# Altium schematic sheet Differential_voltage_input.SchDoc
size A4; SheetNumber: 6; SheetTotal: 8
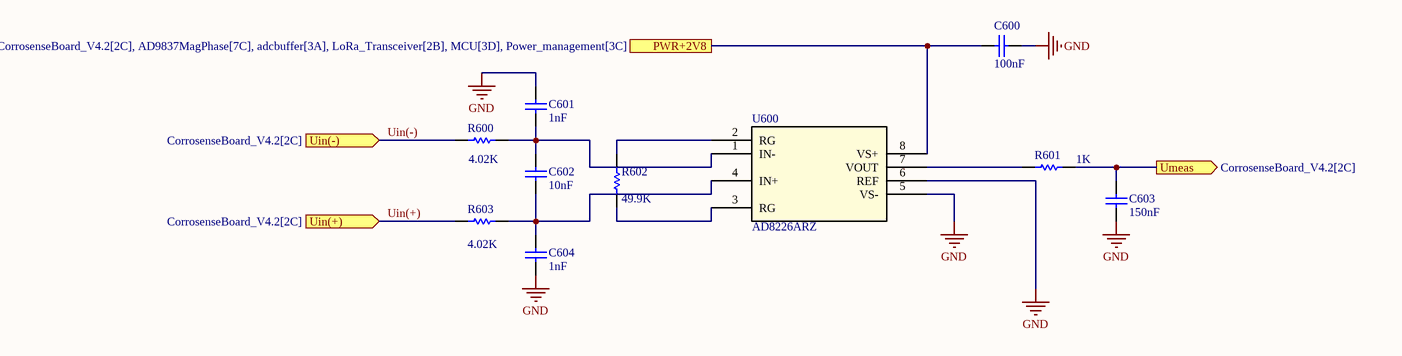
[diagram p0: Differential_voltage_input.SchDoc]

## Parts
C600  100nF  [1608[0603]]
C601  1nF  [1608[0603]]
C602  10nF  [1608[0603]]
C603  150nF  [1608[0603]]
C604  1nF  [1608[0603]]
R600  4.02K  [1608[0603]]
R601  1K  [1608[0603]]
R602  49.9K  [1608[0603]]
R603  4.02K  [1608[0603]]
U600  AD8226ARZ  [SOIC127P600X175-8N]

## Ports
PWR+2V8 (see CorrosenseBoard_V4.2[2C], AD9837MagPhase[7C], adcbuffer[3A], LoRa_Transceiver[2B], MCU[3D], Power_management[3C]), Uin(+) (in, see CorrosenseBoard_V4.2[2C]), Uin(-) (in, see CorrosenseBoard_V4.2[2C]), Umeas (out, see CorrosenseBoard_V4.2[2C])

## Nets
GND: C600.2 C601.1 C603.2 C604.2 U600.5(VS-) U600.6(REF)
PWR+2V8: C600.1 U600.8(VS+) ; port PWR+2V8
Uin(+): R603.1 ; port Uin(+)
Uin(-): R600.1 ; port Uin(-)
Umeas: C603.1 R601.2 ; port Umeas
NetC601_2: C601.2 C602.1 R600.2 U600.1(IN-)
NetC602_2: C602.2 C604.1 R603.2 U600.4(IN+)
NetR601_1: R601.1 U600.7(VOUT)
NetR602_1: R602.1 U600.3(RG)
NetR602_2: R602.2 U600.2(RG)

## Library data of the parts
C600 = Cap: CAP CER 25V X7R 0603; Manufacturer: Murata Electronics; MPN: GCJ188R71E104KA12D; Tolerance: ±10%; Value: 100nF; Operating Temperature: -55°C ~ 125°C; Package / Case: 0603 (1608 Metric); Temperature Coefficient: X7R; Voltage - Rated: 25V
C601 C604 = Cap: CAP CER 25V X7R 0603; Manufacturer: KYOCERA AVX; MPN: 06033C102KAT2A; Tolerance: ±10%; Value: 1nF; Operating Temperature: -55°C ~ 125°C; Package / Case: 0603 (1608 Metric); Temperature Coefficient: X7R; Voltage - Rated: 25V
C602 = Cap: CAP CER 25V X7R 0603; Manufacturer: Murata Electronics; MPN: GCJ188R71E103KA01J; Tolerance: ±10%; Value: 10nF; Operating Temperature: -55°C ~ 125°C; Package / Case: 0603 (1608 Metric); Temperature Coefficient: X7R; Voltage - Rated: 25V
C603 = Cap: CAP CER 25V X7R 0603; Manufacturer: Murata Electronics; MPN: GRM188R71E154KA01D; Tolerance: ±10%; Value: 150nF; Operating Temperature: -55°C ~ 125°C; Package / Case: 0603 (1608 Metric); Temperature Coefficient: X7R; Voltage - Rated: 25V
R600 R603 = Res1: RES SMD 2% 1.5W 0603; Manufacturer: YAGEO; MPN: AF0603FR-074K02L; MP: -65°C ~ 155°C; Publisher: Altium Limited; Value: 4.02K; Code_JEITA: Thick Film; Package: 0603 (1608 Metric); Temperature Coefficient: 2%; Composition: Thick Film; Operating Temperature: -65°C ~ 155°C; Power (Watts): 1.5W; Tolerance: 2%
R601 = Res1: RES SMD 2% 1.5W 0603; Manufacturer: YAGEO; MPN: RC0603FR-071KL; MP: -65°C ~ 155°C; Publisher: Altium Limited; Value: 1K; Code_JEITA: Thick Film; Package: 0603 (1608 Metric); Temperature Coefficient: 2%; Composition: Thick Film; Operating Temperature: -65°C ~ 155°C; Power (Watts): 1.5W; Tolerance: 2%
R602 = Res1: RES SMD 2% 1.5W 0603; Manufacturer: YAGEO; MPN: AC0603FR-0749K9L; MP: -65°C ~ 155°C; Publisher: Altium Limited; Value: 49.9K; Code_JEITA: Thick Film; Package: 0603 (1608 Metric); Temperature Coefficient: 2%; Composition: Thick Film; Operating Temperature: -65°C ~ 155°C; Power (Watts): 1.5W; Tolerance: 2%
U600 = AD8226ARZ: No Description Available; Mfr_Name: Analog Devices Inc; RefDes: RefDes; Type: Type; Manufacturer: Analog Devices Inc; MPN: AD8226ARZ